# EAGLE design Quad_v2.0 (EAGLE 6.3)
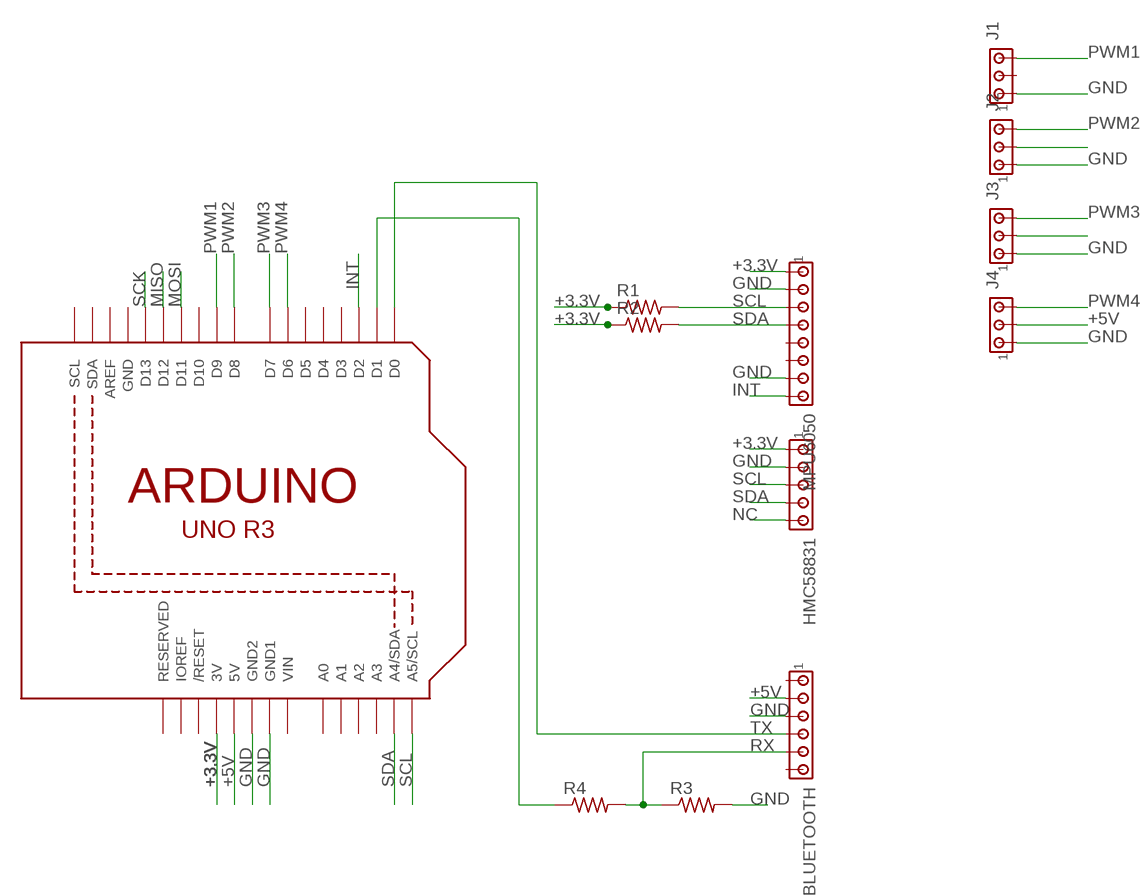
[diagram p0: schematic, sheet 1]

## Parts
BLUETOOTH  MTA06-100  [10X06MTA]
HMC58831  MTA05-100  [10X05MTA]
J1  MTA03-100  [10X03MTA]
J2  MTA03-100  [10X03MTA]
J3  MTA03-100  [10X03MTA]
J4  MTA03-100  [10X03MTA]
MPU6050  MTA08-100  [10X08MTA]
R1  R-US_0204/7  [0204/7]
R2  R-US_0204/7  [0204/7]
R3  R-US_0204/7  [0204/7]
R4  R-US_0204/7  [0204/7]
U1  ARDUINOR3-DIMENSION  [ARDUINOR3]

## Nets
+3.3V: HMC58831.1 MPU6050.1 R1.1 R2.1 U1.3V
+5V: BLUETOOTH.5 J4.2 U1.5V
GND: BLUETOOTH.4 HMC58831.2 J1.1 J2.1 J3.1 J4.1 MPU6050.2 MPU6050.7 R3.2 U1.GND1 U1.GND2
INT: MPU6050.8 U1.D2
MISO: U1.D12
MOSI: U1.D11
N$3: R4.1 U1.D1
N$6: J2.2
N$9: J3.2
NC: HMC58831.5
PWM1: J1.3 U1.D9
PWM2: J2.3 U1.D8
PWM3: J3.3 U1.D7
PWM4: J4.3 U1.D6
RX: BLUETOOTH.2 R3.1 R4.2
SCK: U1.D13
SCL: HMC58831.3 MPU6050.3 R1.2 U1.A5(A5/SCL)
SDA: HMC58831.4 MPU6050.4 R2.2 U1.A4(A4/SDA)
TX: BLUETOOTH.3 U1.D0
Unconnected: BLUETOOTH.1 BLUETOOTH.6 J1.2 MPU6050.5 MPU6050.6 U1.A0 U1.A1 U1.A2 U1.A3 U1.AREF U1.D3 U1.D4 U1.D5 U1.D10 U1.IOREF U1.RESERVED U1.RESET(/RESET) U1.SCL U1.SDA

## Power pins joined to a net without a drawn wire
GND: U1.GND
VIN: U1.VIN

## Library data of the parts
BLUETOOTH = con-amp:MTA06-100: AMP connector
HMC58831 = con-amp:MTA05-100: AMP connector
J1-J4 = con-amp:MTA03-100: AMP connector
MPU6050 = con-amp:MTA08-100: AMP connector
R1-R4 = rcl:R-US_: RESISTOR, American symbol
U1 = adafruit:ARDUINOR3: This is a new object for the new Arduino R3 - with extra pins that you may want to use (such as IOref, and duplicated A4/A5

## Board
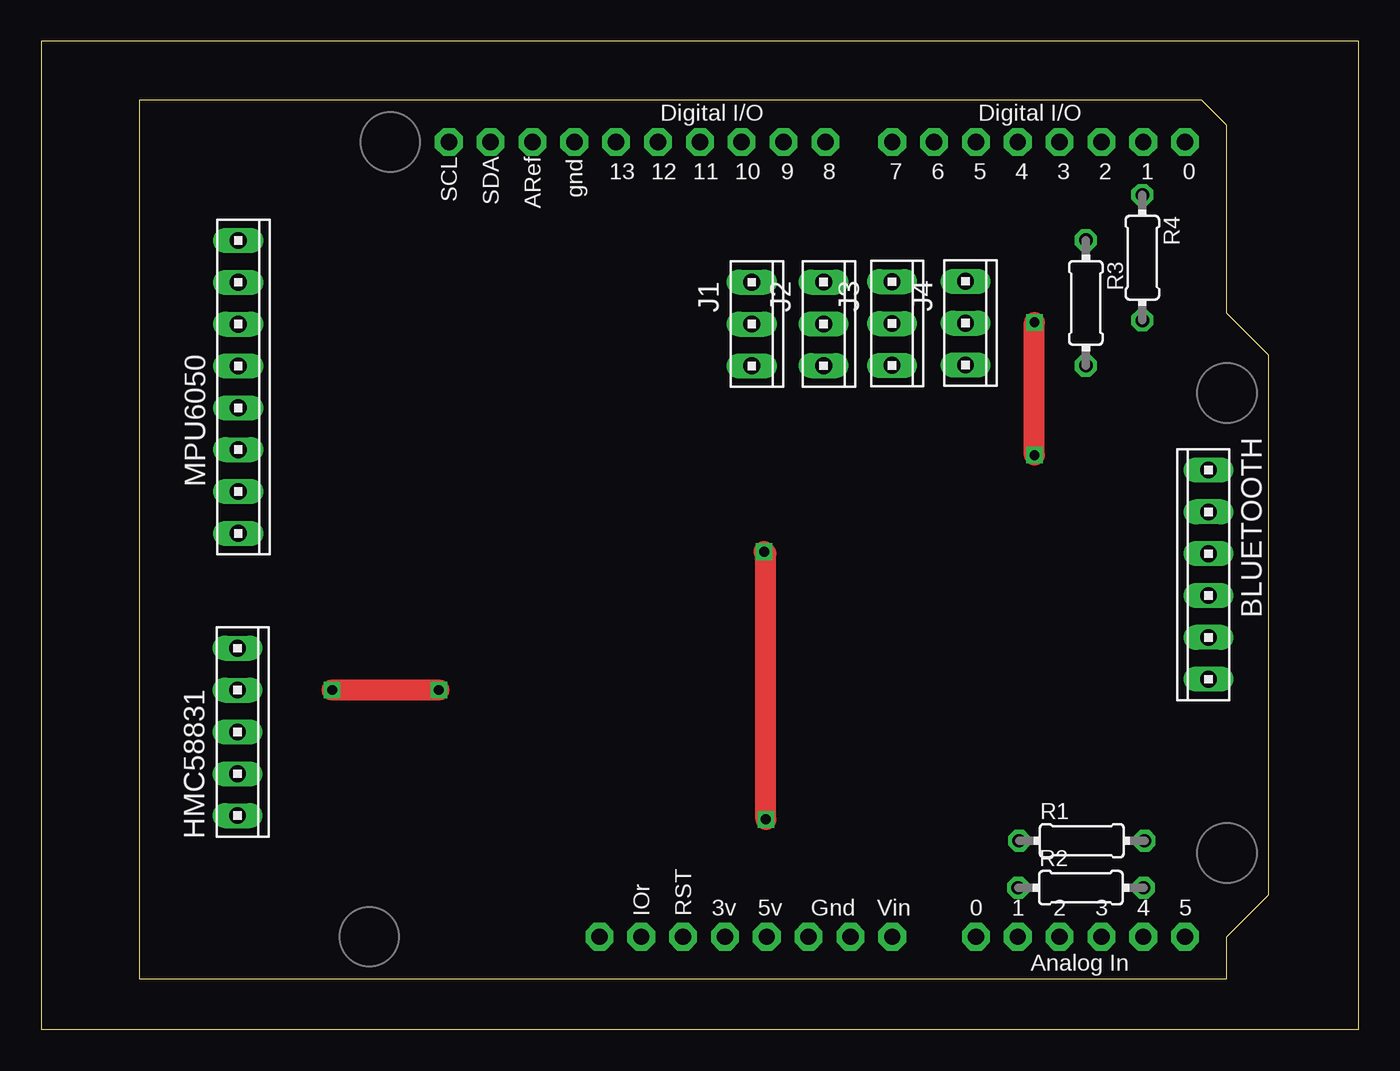
[diagram p1: board, top side]
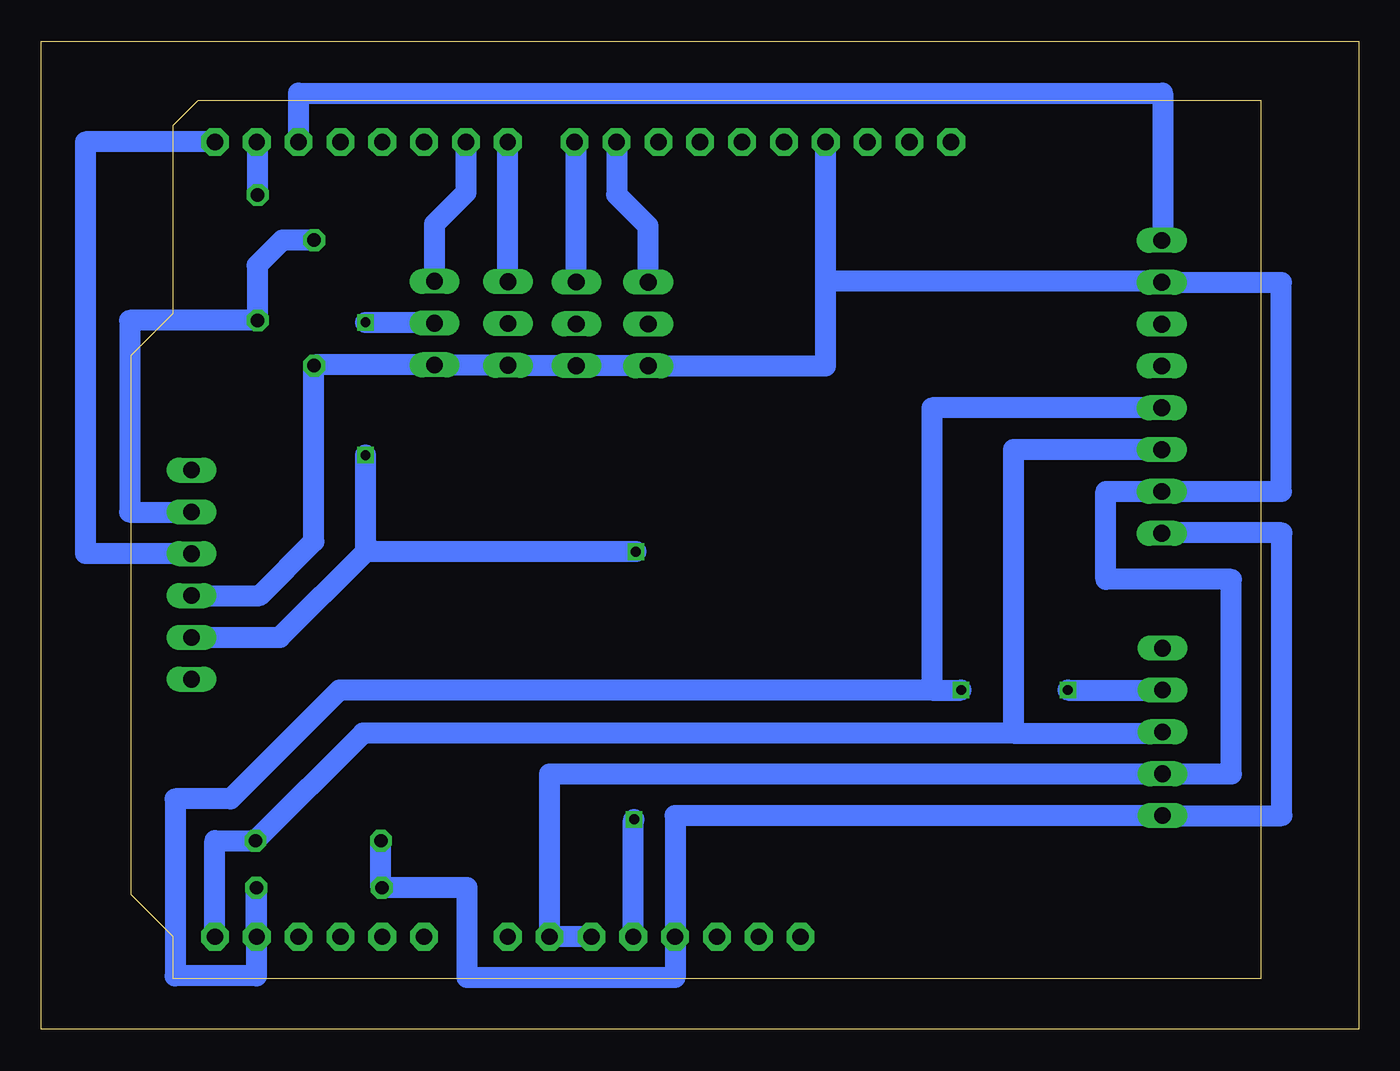
[diagram p2: board, bottom side, seen from below]

Size 80 x 60 mm. Coordinates in mm from the lower left corner, seen from the top.
Outline: 0,0 80,0 80,60 0,60 0,0
Copper layers (1*16): Top 0.035mm / dielectric 1.5mm / Bottom 0.035mm
Design rules "test": minimum track width 40mil, minimum drill 24mil, track to track 25mil, track to pad 25mil, pad to pad 25mil, via to via 25mil, smd to smd 8mil, copper to edge 40mil, drill to drill 8mil, minimum pad ring 10mil, minimum via ring 8mil, stop-mask expansion 4mil, vias tented up to drill 0mil, thermal gap 10mil

### Footprints (pad centres in the part's own frame; a part is rotated, then mirrored left to right if it is on the bottom)
10X06MTA = drill 1.016 long: 1 6.35,0; 2 3.81,0; 3 1.27,0; 4 -1.27,0; 5 -3.81,0; 6 -6.35,0
10X05MTA = drill 1.016 long: 1 5.08,0; 2 2.54,0; 3 0,0; 4 -2.54,0; 5 -5.08,0
10X03MTA = drill 1.016 long: 1 2.54,0; 2 0,0; 3 -2.54,0
10X08MTA = drill 1.016 long: 1 8.89,0; 2 6.35,0; 3 3.81,0; 4 1.27,0; 5 -1.27,0; 6 -3.81,0; 7 -6.35,0; 8 -8.89,0
0204/7 = drill 0.813 octagon: 1 -3.81,0; 2 3.81,0
ARDUINOR3 = drill 1 pad 1.676 octagon: 3V 35.56,2.54; 5V 38.1,2.54; A0 50.8,2.54; A1 53.34,2.54; A2 55.88,2.54; A3 58.42,2.54; A4 60.96,2.54; A5 63.5,2.54; AREF 23.876,50.8; D0 63.5,50.8; D1 60.96,50.8; D2 58.42,50.8; D3 55.88,50.8; D4 53.34,50.8; D5 50.8,50.8; D6 48.26,50.8; D7 45.72,50.8; D8 41.656,50.8; D9 39.116,50.8; D10 36.576,50.8; D11 34.036,50.8; D12 31.496,50.8; D13 28.956,50.8; GND 26.416,50.8; GND1 43.18,2.54; GND2 40.64,2.54; IOREF 30.48,2.54; RESERVED 27.94,2.54; RESET 33.02,2.54; SCL 18.796,50.8; SDA 21.336,50.8; VIN 45.72,2.54

### Placement (x,y rotation side)
BLUETOOTH  70.88,27.61 90 top
HMC58831  11.92,18.06 270 top
J1  43.14,42.83 270 top
J2  47.51,42.84 270 top
J3  51.66,42.86 270 top
J4  56.11,42.88 270 top
MPU6050  11.97,39.01 270 top
R1  63.18,11.45 0 top
R2  63.13,8.6 0 top
R3  63.43,44.11 270 top
R4  66.85,46.85 270 top
U1  5.95,3.09 0 top

### Tracks (layer width: path | path; a pad name or v marks a point on that pad's centre or on a via)
+3.3V
  Bottom 1.27: R1.1 59.37,8.6 R2.1 54.14,8.6 54.14,3.14 41.51,3.14 U1.3V 41.51,12.98 HMC58831.1 4.67,12.98 4.67,30.15 11.97,30.15 MPU6050.1
+5V  (via drill 0.6)
  Top 1.27: v60.31,34.86 v60.31,42.93 | v44,12.75 44,28.9 v43.9,29
  Bottom 1.27: BLUETOOTH.5 65.51,23.8 60.31,29 60.31,29.42 | 60.31,29.42 v60.31,34.86 | v60.31,42.93 56.16,42.93 J4.2 | U1.5V 44.05,12.7 v44,12.75 | v43.9,29 59.89,29 60.31,29.42
GND
  Bottom 1.27: U1.GND2 U1.GND1 49.13,15.52 HMC58831.2 7.73,15.52 7.73,27.33 15.36,27.33 15.36,32.67 MPU6050.2 | MPU6050.2 | 32.37,45.44 32.37,40.29 J1.1 47.5,40.29 J2.1 51.64,40.3 J3.1 56.09,40.32 J4.1 63.38,40.34 R3.2 63.44,40.28 63.44,29.63 66.73,26.34 BLUETOOTH.4 | 32.37,45.44 U1.GND | 32.37,45.44 11.97,45.44 MPU6050.7 11.97,45.33 4.7,45.33 4.7,32.67 MPU6050.2
INT
  Bottom 1.27: U1.D2 64.37,56.85 11.91,56.85 11.91,47.9 MPU6050.8
N$3
  Bottom 1.27: R4.1 66.86,53.83 U1.D1
PWM1
  Bottom 1.27: U1.D9 45.07,50.69 43.17,48.79 43.17,45.6 J1.3
PWM2
  Bottom 1.27: J2.3 47.51,53.79 U1.D8
PWM3
  Bottom 1.27: J3.3 51.66,53.87 U1.D7
PWM4
  Bottom 1.27: U1.D6 54.21,50.81 56.13,48.89 56.13,45.44 J4.3
RX
  Bottom 1.27: R3.1 65.35,47.92 66.89,46.38 66.89,43.08 R4.2 74.63,43.04 74.63,31.41 70.88,31.41 BLUETOOTH.2
SCL
  Bottom 1.27: MPU6050.3 20.98,35.2 20.98,17.99 | 20.98,17.99 11.91,17.99 HMC58831.3 | 20.98,17.99 60.46,17.99 R1.2 69.45,11.46 U1.A5
SDA  (via drill 0.6)
  Top 1.27: v24.14,20.61 v17.66,20.61
  Bottom 1.27: U1.A4 66.94,5.63 R2.2 66.94,3.25 71.87,3.25 71.87,14 68.5,14 61.9,20.61 25.92,20.61 | MPU6050.4 25.92,37.74 25.92,20.61 | 25.92,20.61 v24.14,20.61 | v17.66,20.61 HMC58831.4
TX
  Bottom 1.27: U1.D0 77.31,53.89 77.31,28.9 70.88,28.9 BLUETOOTH.3